# EAGLE design Adafruit 0.54 Alphanumeric STEMMA QT (EAGLE 9.6.2)
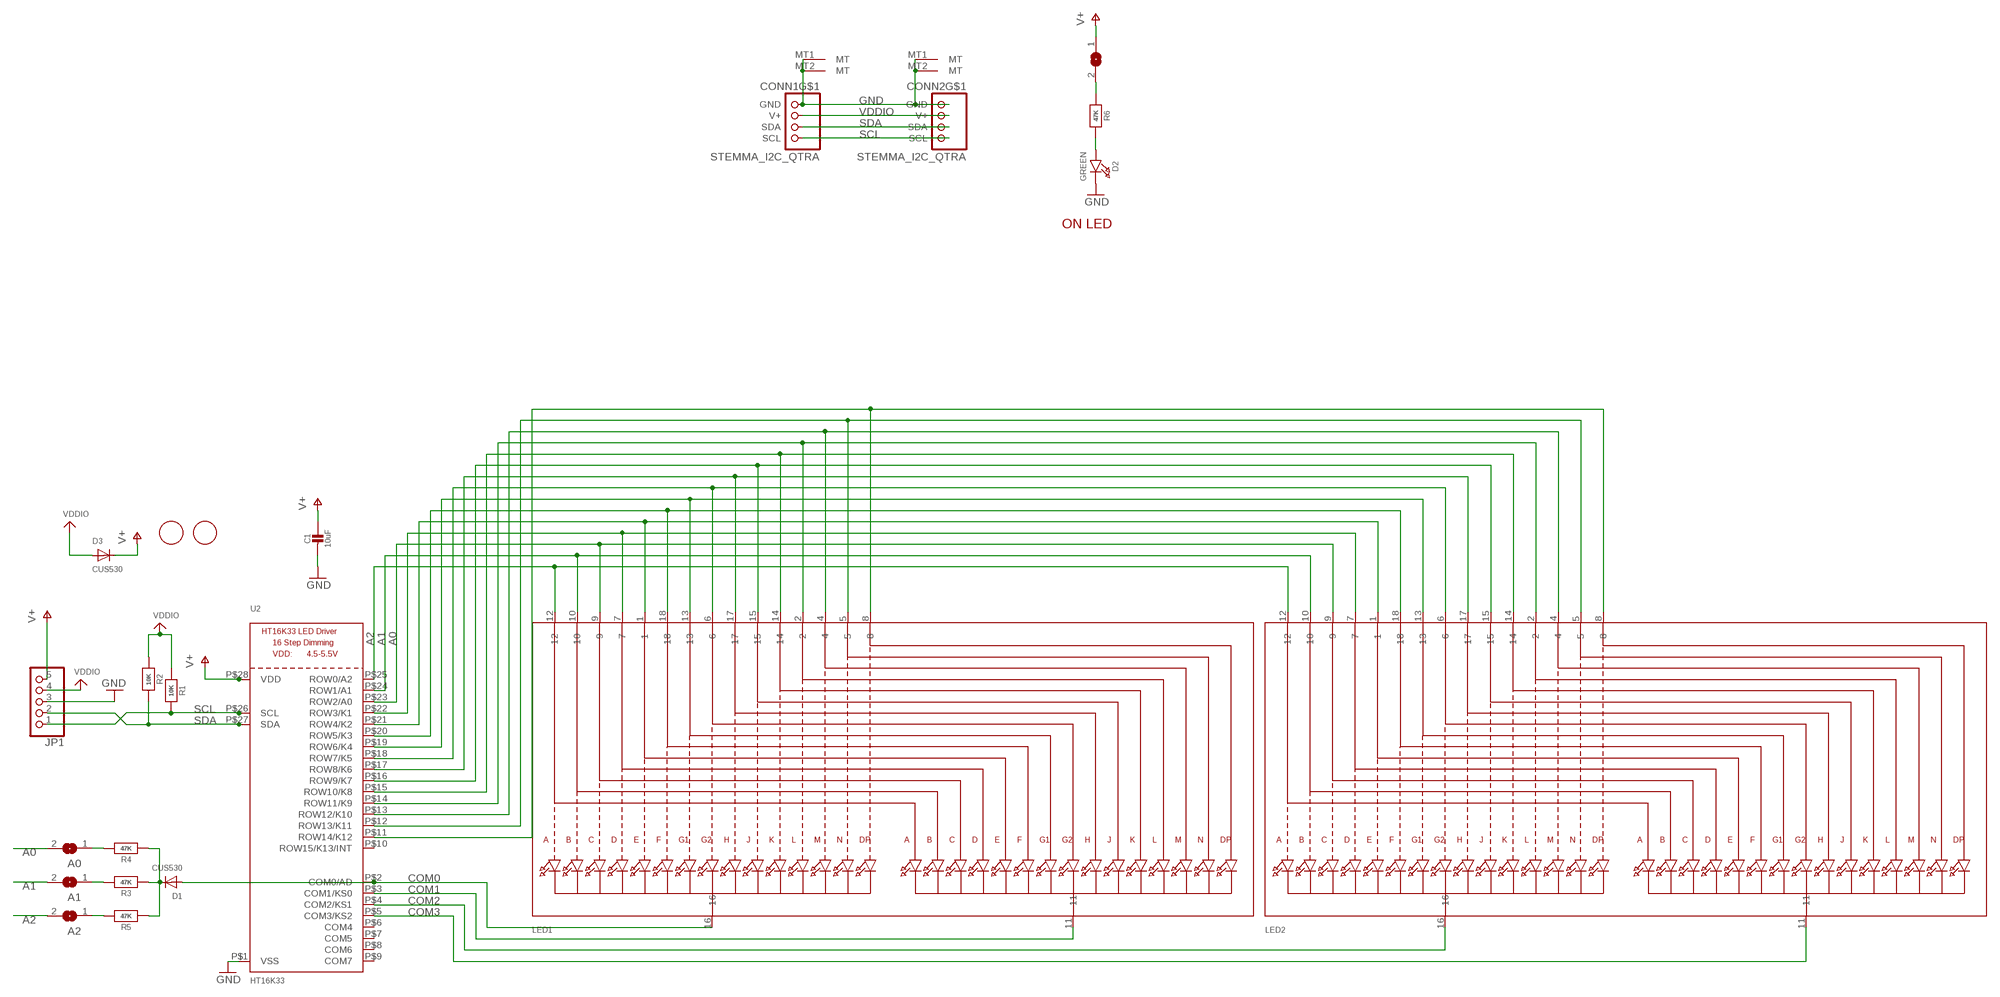
[diagram p0: schematic, sheet 1]

## Parts
A0  SOLDERJUMPERREFLOW_NOPASTE  [SOLDERJUMPER_REFLOW_NOPASTE]
A1  SOLDERJUMPERREFLOW_NOPASTE  [SOLDERJUMPER_REFLOW_NOPASTE]
A2  SOLDERJUMPERREFLOW_NOPASTE  [SOLDERJUMPER_REFLOW_NOPASTE]
C1  10uF  CAP_CERAMIC0805-NOOUTLINE  [0805-NO]
CONN1  STEMMA_I2C_QTRA  [JST_SH4_RA]
CONN2  STEMMA_I2C_QTRA  [JST_SH4_RA]
D1  CUS530  DIODESOD-323F  [SOD-323F]
D2  GREEN  LED0603_NOOUTLINE  [CHIPLED_0603_NOOUTLINE]
D3  CUS530  DIODESOD-323F  [SOD-323F]
JP1  HEADER-1X570MIL  [1X05_ROUND_70]
LED1  DISP_SEGMENT_STARBURST_DUAL_COMMONCATHODE  [SEGMENT_STARTBUST_DUAL_KWA-541CBB]
LED2  DISP_SEGMENT_STARBURST_DUAL_COMMONCATHODE  [SEGMENT_STARTBUST_DUAL_KWA-541CBB]
LEDJMP  SOLDERJUMPERCLOSED  [SOLDERJUMPER_CLOSEDWIRE]
R1  10K  RESISTOR_0603_NOOUT  [0603-NO]
R2  10K  RESISTOR_0603_NOOUT  [0603-NO]
R3  47K  RESISTOR_0603_NOOUT  [0603-NO]
R4  47K  RESISTOR_0603_NOOUT  [0603-NO]
R5  47K  RESISTOR_0603_NOOUT  [0603-NO]
R6  47K  RESISTOR_0603_NOOUT  [0603-NO]
U2  HT16K33  HT16K33_SOP28_SKINNY  [SOP28_300MIL_SKINNY]
U$1  FIDUCIAL  [FIDUCIAL_1MM]
U$2  FIDUCIAL  [FIDUCIAL_1MM]

## Nets
A0: A0.2 LED1.9 LED2.9 U2.P$23(ROW2/A0)
A1: A1.2 LED1.10 LED2.10 U2.P$24(ROW1/A1)
A2: A2.2 LED1.12 LED2.12 U2.P$25(ROW0/A2)
COM0: D1.A LED1.16 U2.P$2(COM0/AD)
COM1: LED1.11 U2.P$3(COM1/KS0)
COM2: LED2.16 U2.P$4(COM2/KS1)
COM3: LED2.11 U2.P$5(COM3/KS2)
GND: C1.2 CONN1.1(GND) CONN1.MT1(MT) CONN1.MT2(MT) CONN2.1(GND) CONN2.MT1(MT) CONN2.MT2(MT) D2.C JP1.3 U2.P$1(VSS)
N$1: D1.C R3.1 R4.1 R5.1
N$3: D2.A R6.2
N$4: LED1.17 LED2.17 U2.P$17(ROW8/K6)
N$5: LED1.15 LED2.15 U2.P$16(ROW9/K7)
N$6: LED1.14 LED2.14 U2.P$15(ROW10/K8)
N$7: A2.1 R5.2
N$8: LED1.2 LED2.2 U2.P$14(ROW11/K9)
N$9: LED1.4 LED2.4 U2.P$13(ROW12/K10)
N$10: LED1.7 LED2.7 U2.P$22(ROW3/K1)
N$11: LED1.1 LED2.1 U2.P$21(ROW4/K2)
N$12: LED1.18 LED2.18 U2.P$20(ROW5/K3)
N$13: LED1.13 LED2.13 U2.P$19(ROW6/K4)
N$14: LED1.5 LED2.5 U2.P$12(ROW13/K11)
N$15: LED1.8 LED2.8 U2.P$11(ROW14/K12)
N$16: LED1.6 LED2.6 U2.P$18(ROW7/K5)
N$17 [lowpower]: LEDJMP.2 R6.1
N$19: A1.1 R3.2
N$20: A0.1 R4.2
SCL: CONN1.4(SCL) CONN2.4(SCL) JP1.1 R1.2 U2.P$26(SCL)
SDA: CONN1.3(SDA) CONN2.3(SDA) JP1.2 R2.2 U2.P$27(SDA)
V+: C1.1 D3.C JP1.5 LEDJMP.1 U2.P$28(VDD)
VDDIO: CONN1.2(V+) CONN2.2(V+) D3.A JP1.4 R1.1 R2.1
Unconnected: U2.P$6(COM4) U2.P$7(COM5) U2.P$8(COM6) U2.P$9(COM7) U2.P$10(ROW15/K13/INT)

## Notes on the sheet
- ON LED

## Library data of the parts
A0 A1 A2 LEDJMP = microbuilder:SOLDERJUMPER: SMD Solder JUMPER Solder the two pads together to create a connection, or remove the solder to break it. REFLOW - Use this footprint for solder paste and reflow ovens. WAVE - Use this footprint for hand-soldering (larger pads). CLOSED - Has a trace between the two pads to ensure it is closed by default. The trace needs to be cut to disable the jumper, and can be closed again by creating a solder bridge between the two pads.
C1 = microbuilder:CAP_CERAMIC: Ceramic Capacitors For new designs, use the packages preceded by an '_' character since they are more reliable: The following footprints should be used on most boards: _0402 - Standard footprint for regular board layouts _0603 - Standard footprint for regular board layouts _0805 - Standard footprint for regular board layouts _1206 - Standard footprint for regular board layouts For extremely tight-pitch boards where space is at a premium, the following 'micro-pitch' footprints can be used (smaller pads, no silkscreen outline, etc.): _0402MP - Micro-pitch footprint for very dense/compact boards _0603MP - Micro-pitch footprint for very dense/compact boards _0805MP - Micro-pitch footprint for very dense/compact boards _1206MP - Micro-pitch footprint for very dense/compact boards
CONN1 CONN2 = microbuilder:STEMMA_I2C
D1 D3 = adafruit:DIODE: Diode SMADIODE - SMA Surface Mount Package 20V 1A Schottky Diode Digikey: 641-1014-6-ND DO-1N4148 - Through Hole Small Current Diode SOD-123 20V 1 A (.5mV Vf) Schottky Diode - Digikey: MBRX120TPMSCT-ND SOD-323 10V 570mA (.38mV Vf, 3ns) Schottky Diode - Digikey: ZLLS410CT-ND SOD-523 30V 30mA Schottky Diode (RB751S-40TE61) - Digikey: RB751S-40TE61CT-ND SOT23-R/W - SOT23 Package (R = Solder Paste/Reflow Ovens, W = Hand-Soldering) BAT54Film 40V 300mA - Digikey: 497-7162-1-ND
D2 = microbuilder:LED: LED 0603 - 0603 Surface Mount Package 2mA: Green LED - Low Power (3.9mcd, 2ma, 1.7Vf) - Digikey: 475-2709-2-ND Orange LED - Low Power (9.8mcd, 2ma, 1.8Vf) - Digikey: 475-1194-2-ND Red LED - Low Power (5mcd, 2ma, 1.8Vf) - Digikey: 475-1195-2-ND Yellow LED - Low Power (7mcd, 2ma, 1.8Vf) - Digikey: 475-1196-2-ND 5mA: Blue LED - Low Power (17mcd, 5ma, 2.9Vf) - Digikey: LNJ937W8CRACT-ND 0805 - 0805 Surface Mount Package 2mA: Red LED (8.8mcd, 2mA, 1.8Vf, Clear) - Low Power [Digikey: 475-2510-1-ND] Green LED (5mcd, 2mA, 1.8Vf, Clear) - Low Power [Digikey: 475-2730-1-ND] Yellow LED (11.3mcd, 2mA, 1.8Vf, Clear) - Low Power [Digikey: 475-2555-1-ND] 20mA: Red LED (104mcd, 20mA, Diffused) - LS R976 [Digikey: 475-1278-6-ND] Red LED (12mcd, 20mA, 2.0Vf, Clear) - APT2012EC [Digikey: 754-1128-1-ND] Green LED (15mcd, 20mA, 2.2Vf, Clear) - APT2012GC [Digikey: 754-1131-1-ND] Orange LED (160mcd, 20mA, 2.1Vf, Clear) - APT2012SECK [Digikey: 754-1130-1-ND] 1206 - 1206 Surface Mount Package Green LED (26mcd, 20mA, Diffused) - LG N971 [Digikey: 475-1407-6-ND] Red LED (15mcd, 20mA, Diffused) - LH N974 [Digikey: 475-1416-6-ND] Cree - Cree High-Power Surface Mount LEDs XPEBWT-L1-0000-00D50 - White 111lm 350mA 2.9Vf 6200K 110° XTEAWT-00-0000-00000LEE3 - White 114lm 350mA 2.85Vf 5000K 115° Everlight - Everlight 45-21 Series Surface Mount LEDs 45-21/QK2C-B2832AC2CB2/2T - Warm White 2000mcd 20mA 3.25Vf 3050K 120° 45-21/LK2C-B38452C4CB2/2T - Nuetral White 2000mcd 20mA 3.25Vf 4150K 120° 45-21/LK2C-B50634C6CB2/2T - Cold White 2200mcd 20mA 3.25Vf 5650K 120° PLCC2 Reverse Mount LS T77K-J1L2-1-0-2-R18-Z - Red 11.25mcd 2mA 1.8Vf 630nm 120° LO T77K-L1M2-24-Z - Orange 19.6mcd 2mA 1.8Vf 606nm 120° LY T77K-K2M1-26-Z - Yellow 15.7mcd 2mA 1.8Vf 587nm 120°
JP1 = microbuilder:HEADER-1X5: PIN HEADER
LED1 LED2 = adafruit_display:DISP_SEGMENT_STARBURST_DUAL_COMMONCATHODE: 2 x Starburst Segment Displays - Common Cathode Luckylight KWA-541CBB
R1-R6 = microbuilder:RESISTOR: Resistors For new designs, use the packages preceded by an '_' character since they are more reliable: The following footprints should be used on most boards: _0402 - Standard footprint for regular board layouts _0603 - Standard footprint for regular board layouts _0805 - Standard footprint for regular board layouts _1206 - Standard footprint for regular board layouts For extremely tight-pitch boards where space is at a premium, the following 'micro-pitch' footprints can be used (smaller pads, no silkscreen outline, etc.): _0402MP - Micro-pitch footprint for very dense/compact boards _0603MP - Micro-pitch footprint for very dense/compact boards _0805MP - Micro-pitch footprint for very dense/compact boards _1206MP - Micro-pitch footprint for very dense/compact boards
U2 = adafruit_display:HT16K33_SOP28
U$1 U$2 = adafruit:FIDUCIAL: For use by pick and place machines to calibrate the vision/machine, 1mm By microbuilder.eu

## Net classes
2 lowpower: width 0.254 mm, drill 0.483 mm

## Board
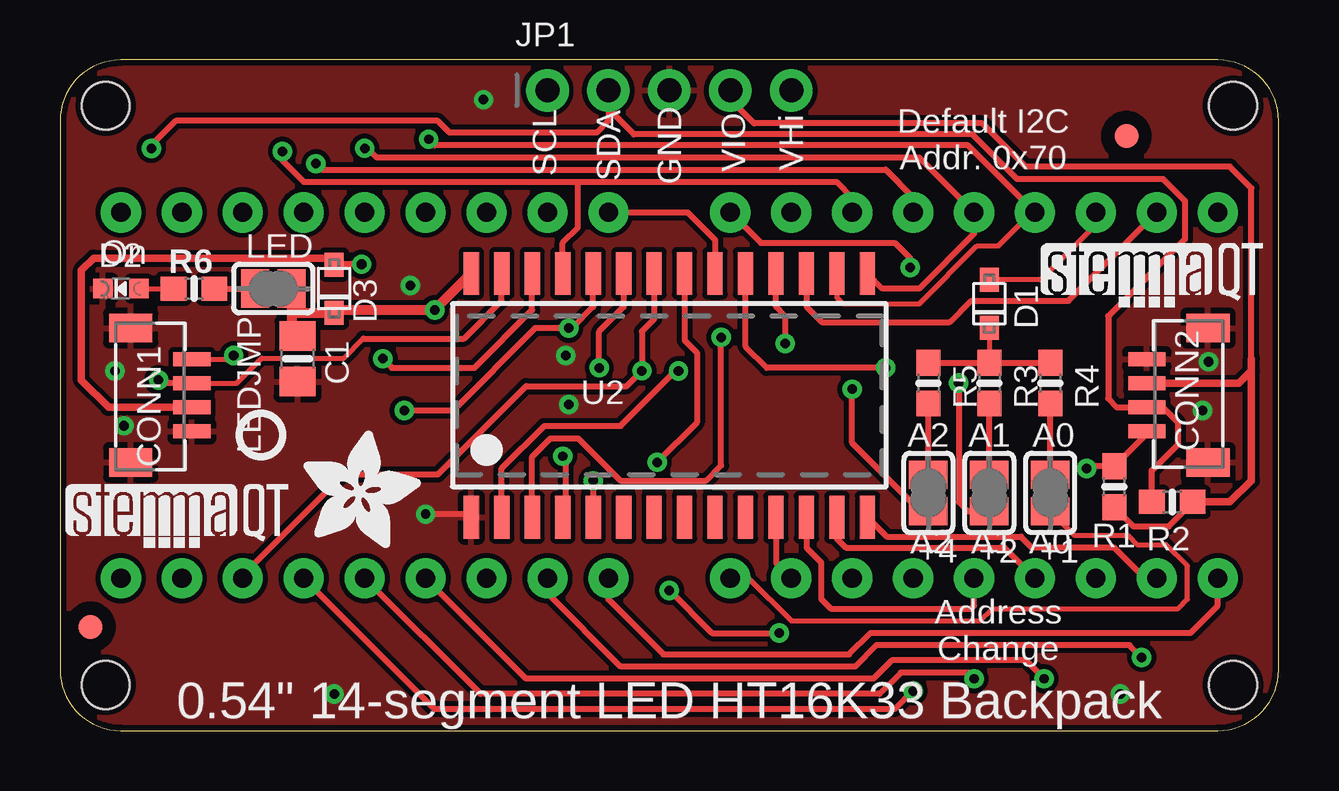
[diagram p1: board, top side]
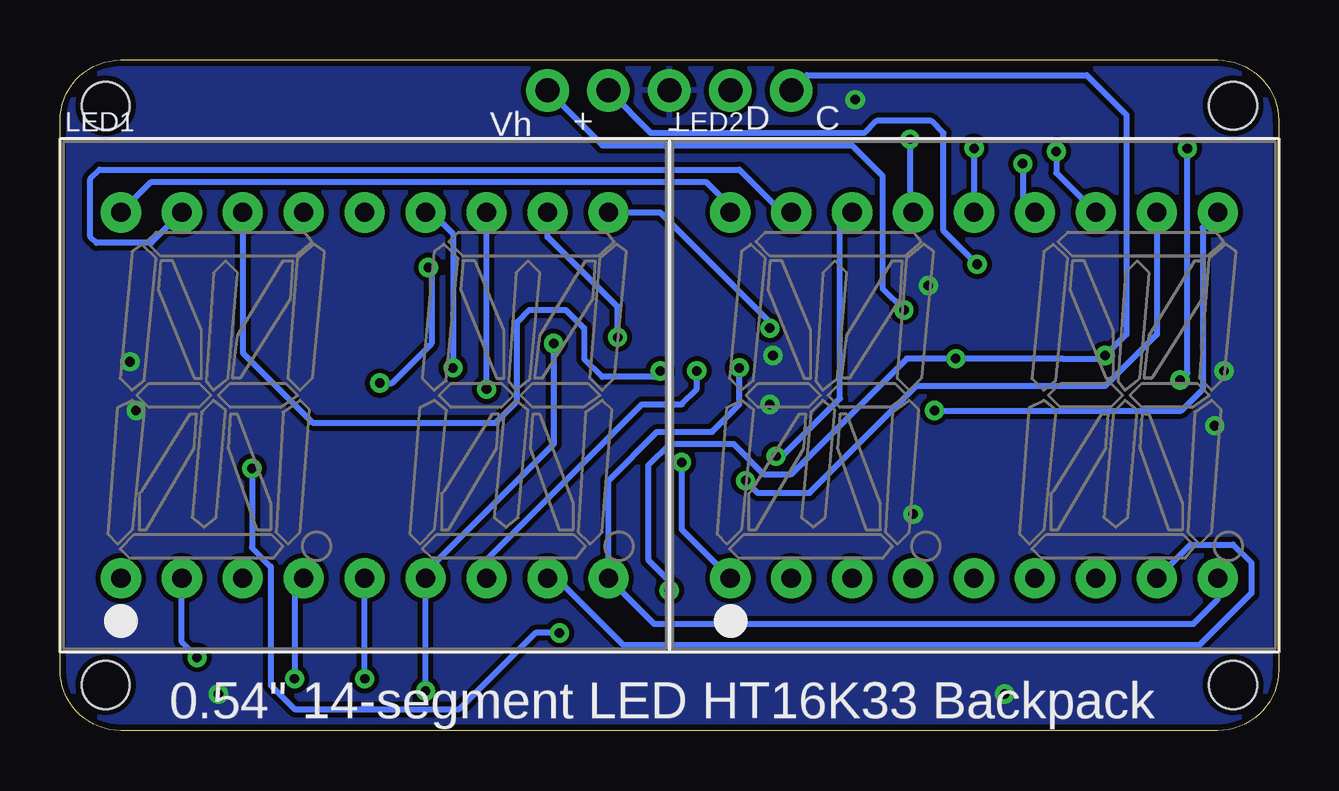
[diagram p2: board, bottom side, seen from below]

Size 50.8 x 27.94 mm. Coordinates in mm from the lower left corner, seen from the top.
Outline: 0,25.4 0,2.54 arc90 2.54,0 48.26,0 arc90 50.8,2.54 50.8,25.4 arc90 48.26,27.94 2.54,27.94 arc90 0,25.4
Copper layers (1*16): Top 0.035mm / dielectric 1.5mm / Bottom 0.035mm
Design rules "adafruit 88": minimum track width 8mil, minimum drill 15.5mil, track to track 8mil, track to pad 8mil, pad to pad 8mil, via to via 8mil, smd to smd 8mil, copper to edge 10mil, drill to drill 8mil, minimum pad ring 10mil, minimum via ring 8mil, stop-mask expansion 2mil, vias tented up to drill 20mil, thermal gap 10mil
Holes 2 mm at 1.9,1.91 48.89,1.91 1.9,26.04 48.89,26.04

### Footprints (pad centres in the part's own frame; a part is rotated, then mirrored left to right if it is on the bottom)
SOLDERJUMPER_REFLOW_NOPASTE = smd 1.168 x 1.6: 1 -0.762,0; 2 0.762,0
0805-NO = smd 1.24 x 1.5: 1 -0.95,0; 2 0.95,0
JST_SH4_RA = smd 0.6 x 1.55: 1 1.5,1.686; 2 0.5,1.686; 3 -0.5,1.686; 4 -1.5,1.686 | smd 1.2 x 1.8: MT1 -2.8,-0.862; MT2 2.8,-0.862
SOD-323F = smd 1 x 0.8: A -1,0; C 1,0
CHIPLED_0603_NOOUTLINE = smd 0.8 x 0.8: A 0,-0.75; C 0,0.75
1X05_ROUND_70 = drill 1 pad 1.778: 1 -5.08,0; 2 -2.54,0; 3 0,0; 4 2.54,0; 5 5.08,0
SEGMENT_STARTBUST_DUAL_KWA-541CBB = drill 0.8 pad 1.676: 1 -10.16,-7.62; 2 -7.62,-7.62; 3 -5.08,-7.62; 4 -2.54,-7.62; 5 0,-7.62; 6 2.54,-7.62; 7 5.08,-7.62; 8 7.62,-7.62; 9 10.16,-7.62; 10 10.16,7.62; 11 7.62,7.62; 12 5.08,7.62; 13 2.54,7.62; 14 0,7.62; 15 -2.54,7.62; 16 -5.08,7.62; 17 -7.62,7.62; 18 -10.16,7.62
SOLDERJUMPER_CLOSEDWIRE = smd 1.168 x 1.6: 1 -0.762,0; 2 0.762,0 | smd 0.635 x 0.203: WIRE 0,0
0603-NO = smd 1.075 x 1: 1 -0.85,0; 2 0.85,0
SOP28_300MIL_SKINNY = smd 0.635 x 1.778: P$1 -8.255,-5.08; P$2 -6.985,-5.08; P$3 -5.715,-5.08; P$4 -4.445,-5.08; P$5 -3.175,-5.08; P$6 -1.905,-5.08; P$7 -0.635,-5.08; P$8 0.635,-5.08; P$9 1.905,-5.08; P$10 3.175,-5.08; P$11 4.445,-5.08; P$12 5.715,-5.08; P$13 6.985,-5.08; P$14 8.255,-5.08; P$15 8.255,5.08; P$16 6.985,5.08; P$17 5.715,5.08; P$18 4.445,5.08; P$19 3.175,5.08; P$20 1.905,5.08; P$21 0.635,5.08; P$22 -0.635,5.08; P$23 -1.905,5.08; P$24 -3.175,5.08; P$25 -4.445,5.08; P$26 -5.715,5.08; P$27 -6.985,5.08; P$28 -8.255,5.08
FIDUCIAL_1MM = smd 1 x 1: 1 0,0

### Placement (x,y rotation side)
A0  41.27,9.91 270 top
A1  38.73,9.91 270 top
A2  36.2,9.91 270 top
C1  9.91,15.49 270 top
CONN1  3.81,13.97 270 top
CONN2  46.99,13.97 90 top
D1  38.73,17.78 270 top
D2  2.54,18.41 90 top
D3  11.43,18.41 270 top
JP1  25.4,26.67 0 top
LED1  38.1,13.97 0 bottom
LED2  12.7,13.97 0 bottom
LEDJMP  8.89,18.41 180 top
R1  43.94,10.16 90 top
R2  46.35,9.53 180 top
R3  38.73,14.48 270 top
R4  41.27,14.48 270 top
R5  36.2,14.48 270 top
R6  5.59,18.41 180 top
U2  25.4,13.97 0 top
U$1  44.45,24.77 0 top
U$2  1.27,4.32 0 top
U$3  [ADAFRUIT_5MM]  10.16,7.62 0 top
U$6  [STEMMAQT]  0.25,7.62 0 top
U$7  [STEMMAQT]  40.89,17.65 0 top
U$8  [PCBFEAT-REV-040]  8.38,12.32 0 top

### Tracks (layer width: path | path; a pad name or v marks a point on that pad's centre or on a via)
A0  (via drill 0.39)
  Top 0.203: LED1.9 28.7,6.35 30.48,4.57 38.35,4.57 38.86,5.08 46.61,5.08 46.99,5.46 46.99,6.86 46.1,7.75 44.89,7.75 44.51,8.13 42.29,8.13 A0.2
  Top 0.254: U2.P$23 23.49,17.65 22.48,16.64 v22.48,15.11
  Bottom 0.254: v22.48,15.11 22.48,13.59 23.62,12.45 25.91,12.45 27.94,10.41 LED1.9 26.04,4.45 3.56,4.45 2.54,5.46 LED2.9
A1  (via drill 0.39, 0.4)
  Top 0.254: U2.P$24 22.22,17.65 21.34,16.76 v21.21,16.76 19.81,16.76 16.38,13.34 v14.35,13.34 | LED1.10 29.21,20.32 34.8,20.32 35.44,19.68 v35.44,19.3 | v37.46,14.48 37.46,9.53 37.85,9.14 A1.2
  Bottom 0.254: LED1.10 25.78,21.59 21.21,17.02 v21.21,16.76 | v14.35,13.34 4.06,13.34 3.17,14.22 3.17,20.96 LED2.10 | v35.44,19.3 35.31,19.17 35.31,16.12 36.96,14.48 v37.46,14.48
A2  (via drill 0.39, 0.4)
  Top 0.254: v9.27,24.13 9.27,23.75 10.16,22.86 21.59,22.86 | 21.59,22.86 32.38,22.86 33.02,22.23 LED1.12 | A2.2 35.87,9.14 33.02,11.99 v33.02,14.22 | U2.P$25 20.95,20.32 21.59,20.96 21.59,22.86
  Bottom 0.254: LED2.12 9.27,23.24 v9.27,24.13 | v33.02,14.22 LED1.12
COM0  (via drill 0.4)
  Top 0.203: LED1.16 43.18,21.08 40.88,18.78 D1.A
  Top 0.254: U2.P$2 18.41,10.92 20.19,12.7 23.37,12.7 25.65,14.99 v25.78,14.99
  Bottom 0.254: v25.78,14.99 26.04,14.73 28.19,14.73 28.96,15.49 28.96,16.76 29.72,17.53 31.24,17.53 31.75,17.02 31.75,13.72 32.64,12.83 40.26,12.83 43.18,15.75 LED1.16
COM1  (via drill 0.39)
  Top 0.254: U2.P$3 19.68,11.42 20.45,12.18 21.6,12.18 23.37,10.41 26.92,10.41 27.56,11.05 v27.56,16.38
  Bottom 0.254: v27.56,16.38 27.56,17.65 30.48,20.57 LED1.11
COM2  (via drill 0.39)
  Top 0.254: v20.95,11.43 20.95,11.3 21.08,11.18 21.08,9.02 U2.P$4
  Bottom 0.254: v20.95,11.43 20.7,11.43 18.29,13.84 18.29,21.21 17.91,21.59 LED2.16
COM3  (via drill 0.39)
  Top 0.254: v22.22,10.41 U2.P$5
  Bottom 0.254: LED2.11 5.08,16.51 7.24,14.35 15.11,14.35 19.56,9.91 21.72,9.91 v22.22,10.41
GND  (via drill 0.39, 0.4)
  Top 0.254: U2.P$1 17.14,9.02 v15.24,9.02
  other vias: 14.6,18.54 2.67,12.7 47.62,13.34 47.88,15.37 17.65,26.29 21.08,15.62 21.21,13.59 44.2,1.52 11.43,1.52 2.29,14.99
  pour Bottom: 0,27.94 0,0 50.8,0 50.8,27.94
  pour Top: 0,27.94 0,0 50.8,0 50.8,27.94
N$1
  Top 0.203: D1.C R3.1
  Top 0.254: R5.1 R3.1 R4.1
N$3
  Top 0.203: D2.A R6.2
N$4
  Top 0.254: U2.P$17 31.11,17.65 31.75,17.02 37.08,17.02 37.97,17.91 42.04,17.91 LED1.17
  Bottom 0.254: LED1.17 46.99,20.32 49.28,20.32 49.53,20.57 49.53,22.99 49.15,23.37 22.48,23.37 20.7,21.59 LED2.17
N$5  (via drill 0.39)
  Top 0.203: U2.P$16 32.38,18.03 32.64,17.78 35.81,17.78 38.23,20.19 39.12,20.19 40.58,21.65
  Top 0.254: LED1.15 40.58,21.65 37.85,24.38 15.62,24.38 v15.37,24.64
  Bottom 0.254: v15.37,24.64 15.37,21.72 LED2.15
N$6  (via drill 0.39)
  Top 0.254: v12.7,24.26 12.83,24.26 13.21,23.88 35.81,23.88 LED1.14 38.1,20.7 35.81,18.41 34.29,18.41 U2.P$15
  Bottom 0.254: v12.7,24.26 LED2.14
N$7
  Top 0.254: A2.1 R5.2
N$8  (via drill 0.39)
  Top 0.254: LED2.2 20.32,5.71 23.37,2.67 33.15,2.67 34.04,3.56 44.58,3.56 v45.08,3.05 | U2.P$14 34.47,8.08 40.06,8.08 40.51,7.62 43.94,7.62 45.21,6.35 LED1.2
  Bottom 0.254: v45.08,3.05 45.72,3.68 LED1.2
N$9  (via drill 0.39)
  Top 0.254: LED2.4 19.43,2.16 33.91,2.16 34.67,2.92 40.26,2.92 v41.02,2.16 | U2.P$13 32.38,8 32.77,7.62 39.37,7.62 LED1.4
  Bottom 0.254: LED1.4 41.02,5.97 v41.02,2.16
N$10  (via drill 0.39)
  Top 0.254: U2.P$22 24.76,17.14 24.26,16.64 v24.26,14.99 23.62,14.35 19.43,14.35 15.75,10.67 11.81,10.67 7.62,6.48 LED2.7
  Bottom 0.254: LED1.7 33.02,7.11 26.54,13.59 24.89,13.59 24.26,14.22 v24.26,14.99
N$11  (via drill 0.39)
  Top 0.254: LED2.1 22.86,5.46 25.15,3.18 32.89,3.18 33.78,4.06 47.12,4.06 48.26,5.21 LED1.1 | U2.P$21 26.04,16.26 26.54,15.75 26.54,12.83 v24.89,11.18
  Bottom 0.254: v24.89,11.18 24.89,8.38 LED2.1
N$12
  Top 0.254: LED2.18 26.16,21.59 27.3,20.45 U2.P$20
  Bottom 0.254: LED1.18 46.99,22.86 23.88,22.86 22.86,21.84 LED2.18
N$13  (via drill 0.39)
  Top 0.254: v10.67,23.62 10.92,23.37 34.42,23.37 35.56,22.23 LED1.13 | v34.42,15.11 29.46,15.11 28.57,16 U2.P$19
  Bottom 0.254: v10.67,23.62 10.67,22.1 LED2.13 | LED1.13 35.31,21.59 34.42,20.7 v34.42,15.11
N$14  (via drill 0.39)
  Top 0.254: LED2.5 17.53,1.52 34.16,1.52 35.05,2.41 37.85,2.41 v38.1,2.16 | U2.P$12 31.11,7.62 31.72,7.01 31.72,5.49 32.13,5.08 37.97,5.08 38.1,5.21 LED1.5
  Bottom 0.254: v38.1,2.16 LED1.5
N$15
  Top 0.254: U2.P$11 29.84,6.99 LED1.8
  Bottom 0.254: LED2.8 3.68,7.75 1.9,7.75 1.14,6.99 1.14,5.71 3.3,3.56 27.3,3.56 30.1,6.35 LED1.8
N$16  (via drill 0.39)
  Top 0.254: U2.P$18 29.84,17.65 30.23,17.27 v30.23,16.13 | LED2.6 15.62,0.89 34.8,0.89 v35.56,1.65
  Bottom 0.254: v30.23,16.13 30.23,11.94 35.56,6.6 LED1.6 v35.56,1.65
N$17
  Top 0.254: R6.1 LEDJMP.2
N$19
  Top 0.254: A1.1 R3.2
N$20
  Top 0.254: A0.1 R4.2
SCL  (via drill 0.39, 0.4)
  Top 0.203: CONN1.4 7.09,15.47 v7.24,15.62
  Top 0.254: v13.46,15.49 13.84,15.11 17.27,15.11 19.68,17.53 U2.P$26 | CONN2.4 45.3,12.37 R1.2 42.89,11.01 v42.8,10.92 | v25.4,5.84 27.18,4.06 v29.97,4.06 v29.98,4.07
  Bottom 0.254: JP1.1 19.68,27.3 8,27.3 6.35,25.65 6.35,18.16 6.35,16.51 v7.24,15.62 7.3,15.56 7.37,15.49 9.02,15.49 v13.46,15.49 15.51,15.49 20.33,10.67 21.45,10.67 22.72,11.94 25.4,11.94 26.29,11.05 26.29,7.11 25.4,6.22 v25.4,5.84 | v42.8,10.92 42.8,7.62 42.01,6.83 42.01,1.88 41.02,0.89 34.16,0.89 30.98,4.07 v29.98,4.07
SDA  (via drill 0.4)
  Top 0.203: CONN1.3 7.36,14.47 8.41,15.52 11.84,15.52 12.64,16.33
  Top 0.254: U2.P$27 18.41,17.91 16.83,16.33 12.64,16.33 | R2.2 45.5,10.83 46.61,11.94 46.61,12.83 45.97,13.47 CONN2.3 44.06,13.47 43.69,13.84 43.69,17.27 46.89,20.47 46.89,22.07 45.97,22.99 39.89,22.99 38.03,24.84 23.93,24.84 22.73,26.04 22.73,26.54 JP1.2 22.86,25.4 22.38,24.92 16.23,24.92 15.75,25.4 4.83,25.4 3.81,24.38 v3.81,24.26 | CONN1.3 4.25,14.47 v4.11,14.61
  Bottom 0.254: v4.11,14.61 3.81,14.91 v3.81,24.26
V+  (via drill 0.39)
  Top 0.406: LEDJMP.1 9.65,17.65 | 9.65,17.65 9.65,16.7 C1.1 | 9.65,17.65 9.89,17.41 D3.C 11.54,17.53 v15.62,17.53 U2.P$28
  Bottom 0.254: v15.62,17.53 16.51,18.41 16.51,23.11 17.78,24.38 28.19,24.38 JP1.5
VDDIO  (via drill 0.4)
  Top 0.254: R1.1 44.74,8.51 46.23,8.51 47.24,9.53 | v12.57,19.43 11.43,19.43 D3.A | 49.66,15.49 49.66,22.61 48.77,23.5 40.26,23.5 38.46,25.3 28.93,25.3 27.94,26.29 JP1.4
  Top 0.305: CONN2.2 49.14,14.47 49.66,14.99 | 49.66,14.99 49.66,15.49 | R2.1 47.24,9.53 48.77,9.53 49.66,10.41 49.66,14.99 | CONN1.2 2.02,13.47 0.89,14.61 0.89,19.18 1.4,19.69 11.16,19.69 D3.A
  Bottom 0.254: v12.57,19.43 13.97,20.83 13.97,24.89 14.48,25.4 16.76,25.4 17.27,24.89 26.16,24.89 JP1.4

### Text on the board
tPlace: SCL | VIO | VHi | Default I2C / Addr. 0x70 | SDA | GND | On | LED | A2 | A1 | A0 | +4 | +2 | +1 | Address / Change | 0.54" 14-segment LED HT16K33 Backpack
bPlace: C | D | - | + | Vh | 0.54" 14-segment LED HT16K33 Backpack